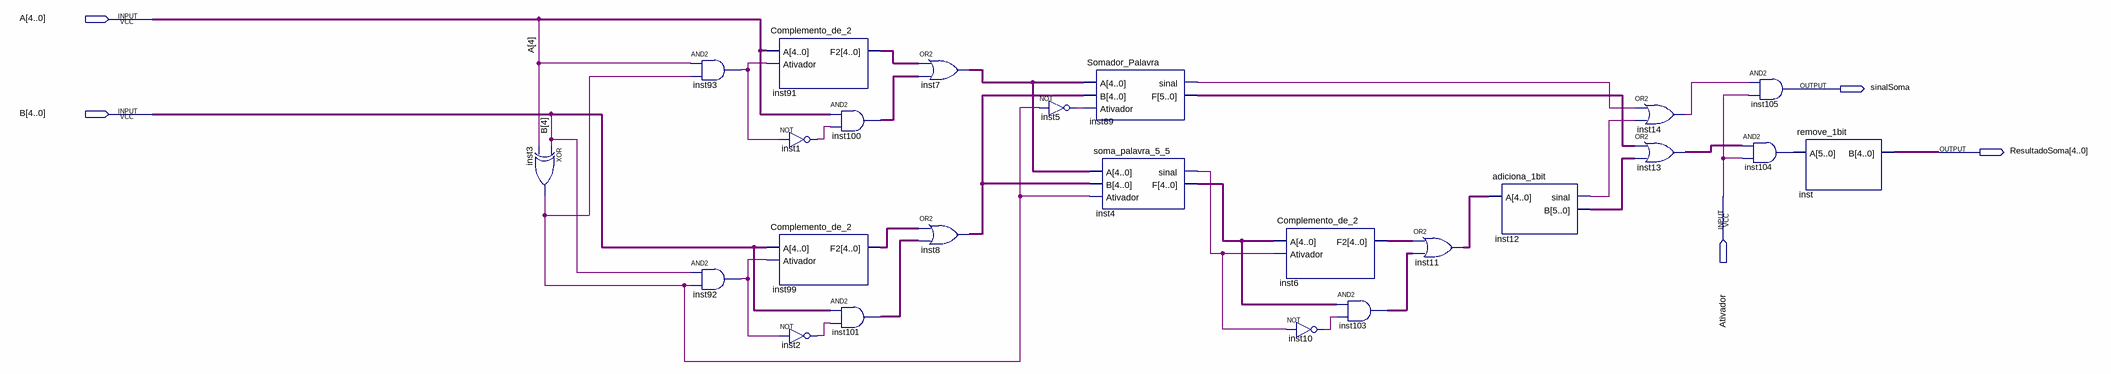
[diagram p0: schematic sheet]
// Quartus schematic Somador_Final.bdf as structural Verilog: 24 symbols, 5 pins
module Somador_Final (
  input  [4:0] A,
  input  [4:0] B,
  input  Ativador,
  output sinalSoma,
  output [4:0] ResultadoSoma
);

  wire inst1_out, inst2_out, inst3_out, inst4_sinal, inst5_out, inst10_out, inst12_sinal, inst14_out,
       inst89_sinal, inst92_out, inst93_out;
  wire [4:0] inst4_f, inst6_f2, inst7_out, inst8_out, inst11_out, inst91_f2, inst99_f2, inst100_out,
       inst101_out, inst103_out;
  wire [5:0] inst12_b, inst13_out, inst89_f, inst104_out;

  xor inst3 (inst3_out, B[4], A[4]);
  and inst93 (inst93_out, A[4], inst3_out);
  and inst92 (inst92_out, B[4], inst3_out);
  Complemento_de_2 inst91 (.A(A), .Ativador(inst93_out), .F2(inst91_f2));
  not inst1 (inst1_out, inst93_out);
  Complemento_de_2 inst99 (.A(B), .Ativador(inst92_out), .F2(inst99_f2));
  not inst2 (inst2_out, inst92_out);
  assign inst100_out = A & {5{inst1_out}};  // AND2 inst100, 5 bits wide
  assign inst101_out = B & {5{inst2_out}};  // AND2 inst101, 5 bits wide
  assign inst7_out = inst91_f2 | inst100_out;  // OR2 inst7, 5 bits wide
  assign inst8_out = inst99_f2 | inst101_out;  // OR2 inst8, 5 bits wide
  not inst5 (inst5_out, inst3_out);
  Somador_Palavra inst89 (.A(inst7_out), .B(inst8_out), .Ativador(inst5_out), .sinal(inst89_sinal), .F(inst89_f));
  soma_palavra_5_5 inst4 (.A(inst7_out), .B(inst8_out), .Ativador(inst3_out), .sinal(inst4_sinal), .F(inst4_f));
  Complemento_de_2 inst6 (.A(inst4_f), .Ativador(inst4_sinal), .F2(inst6_f2));
  not inst10 (inst10_out, inst4_sinal);
  assign inst103_out = inst4_f & {5{inst10_out}};  // AND2 inst103, 5 bits wide
  assign inst11_out = inst6_f2 | inst103_out;  // OR2 inst11, 5 bits wide
  adiciona_1bit inst12 (.A(inst11_out), .sinal(inst12_sinal), .B(inst12_b));
  or inst14 (inst14_out, inst89_sinal, inst12_sinal);
  assign inst13_out = inst89_f | inst12_b;  // OR2 inst13, 6 bits wide
  and inst105 (sinalSoma, inst14_out, Ativador);
  assign inst104_out = inst13_out & {6{Ativador}};  // AND2 inst104, 6 bits wide
  remove_1bit inst (.A(inst104_out), .B(ResultadoSoma));
endmodule
